# EAGLE design AD8232_Heart_Rate_Monitor_v10 (EAGLE 9.6.2)
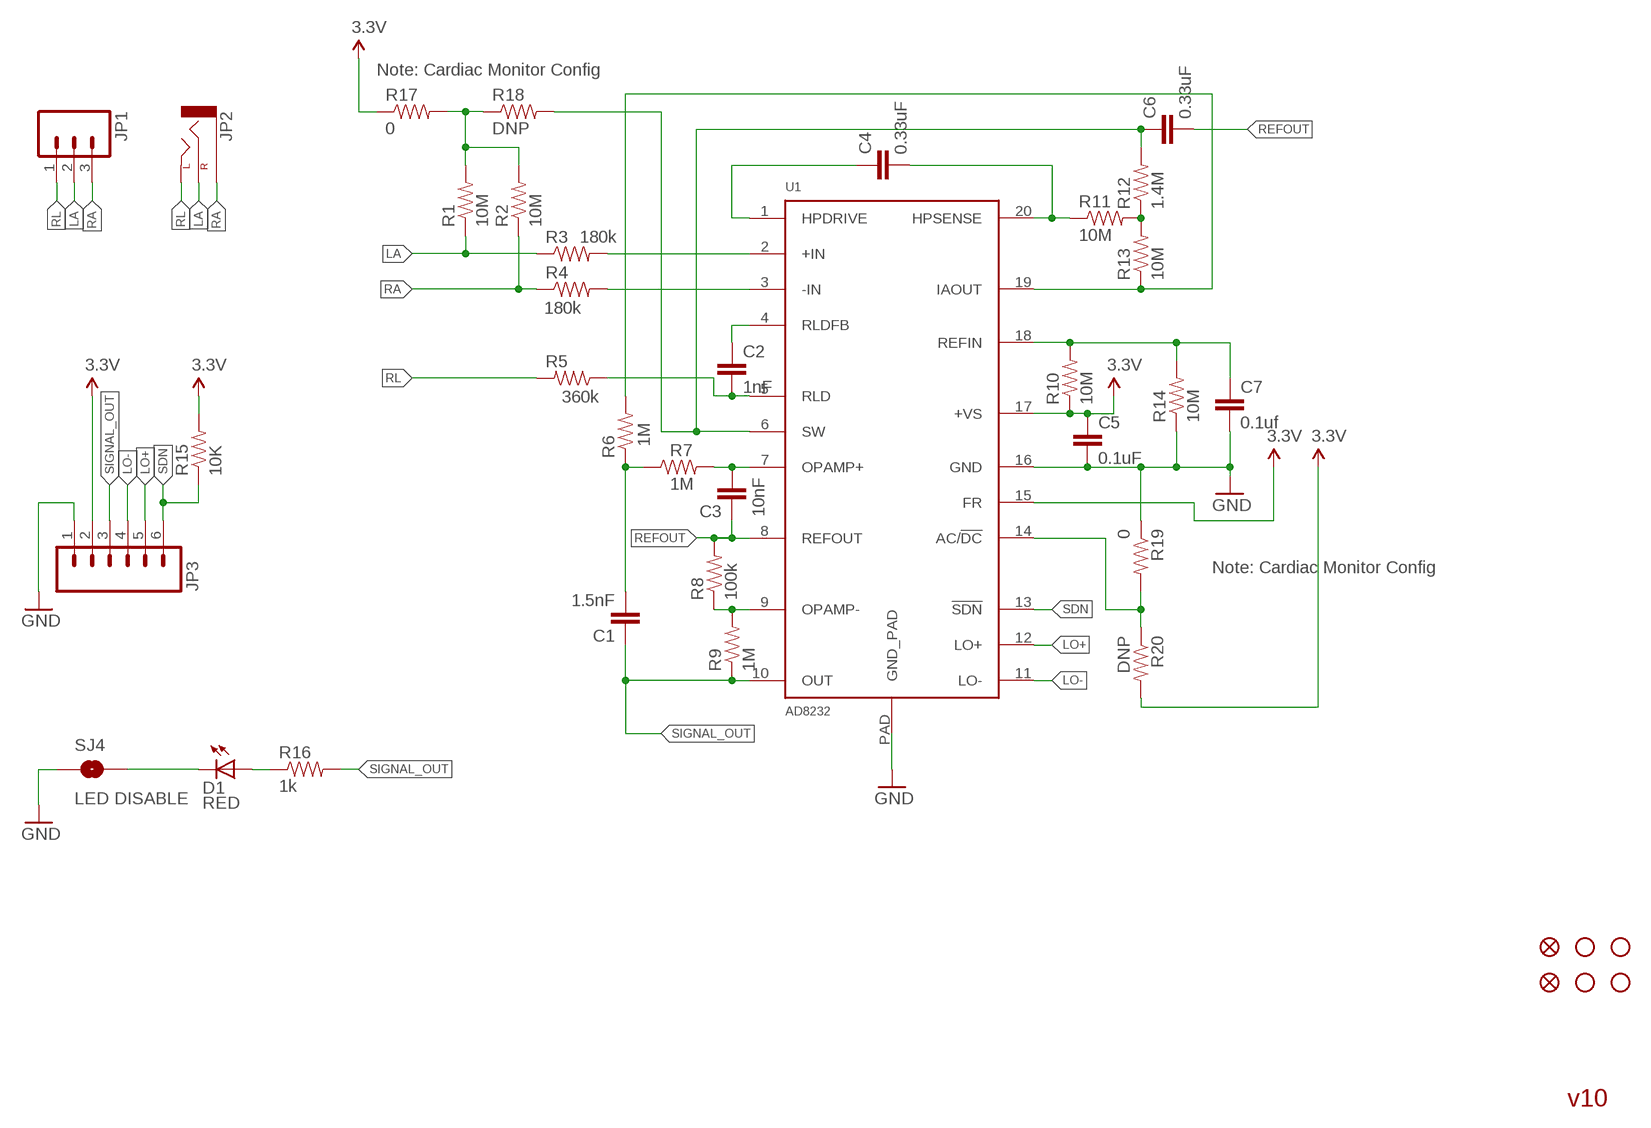
[diagram p0: schematic, sheet 1]

## Parts
C1  1.5nF  CAP0603-CAP  [0603-CAP]
C2  1nF  CAP0603-CAP  [0603-CAP]
C3  10nF  CAP0603-CAP  [0603-CAP]
C4  0.33uF  CAP0805  [0805]
C5  0.1uF  CAP0603-CAP  [0603-CAP]
C6  0.33uF  CAP0805  [0805]
C7  0.1uf  CAP0603-CAP  [0603-CAP]
D1  RED  LED-RED0603  [LED-0603]
FID1  FIDUCIAL1X2  [FIDUCIAL-1X2]
FID2  FIDUCIAL1X2  [FIDUCIAL-1X2]
JP1  M03PTH  [1X03]
JP2  AUDIO-JACKSMD2  [AUDIO-JACK-3.5MM-SMD]
JP3  M06SIP  [1X06]
R1  10M  RESISTOR0603-RES  [0603-RES]
R2  10M  RESISTOR0603-RES  [0603-RES]
R3  180k  RESISTOR0603-RES  [0603-RES]
R4  180k  RESISTOR0603-RES  [0603-RES]
R5  360k  RESISTOR0603-RES  [0603-RES]
R6  1M  RESISTOR0603-RES  [0603-RES]
R7  1M  RESISTOR0603-RES  [0603-RES]
R8  100k  RESISTOR0603-RES  [0603-RES]
R9  1M  RESISTOR0603-RES  [0603-RES]
R10  10M  RESISTOR0603-RES  [0603-RES]
R11  10M  RESISTOR0603-RES  [0603-RES]
R12  1.4M  RESISTOR0603-RES  [0603-RES]
R13  10M  RESISTOR0603-RES  [0603-RES]
R14  10M  RESISTOR0603-RES  [0603-RES]
R15  10K  10KOHM1/10W1%(0603)0603  [0603-RES]
R16  1k  1K-1%  [0603-RES]
R17  0  0OHM1/10W5%(0603)  [0603]
R18  DNP  0OHM1/10W5%(0603)  [0603]
R19  0  0OHM1/10W5%(0603)  [0603]
R20  DNP  0OHM1/10W5%(0603)  [0603]
SJ4  LED DISABLE  SOLDERJUMPERTRACE  [SJ_2S-TRACE]
STANDOFF1  STAND-OFF  [STAND-OFF]
STANDOFF2  STAND-OFF  [STAND-OFF]
STANDOFF3  STAND-OFF  [STAND-OFF]
STANDOFF4  STAND-OFF  [STAND-OFF]
U1  AD8232  [LFCSP_20]

## Nets
3.3V: C5.1 JP3.2 R10.1 R15.2 R17.1 R20.2 U1.15(FR) U1.17(+VS)
GND: C5.2 C7.2 JP3.1 R14.1 R19.1 SJ4.1 U1.16(GND) U1.PAD(GND_PAD)
LA: JP1.2 JP2.RING(RIGHT) R1.1 R3.1
LO+: JP3.5 U1.12(LO+)
LO-: JP3.4 U1.11(LO-)
N$1: R3.2 U1.2(+IN)
N$2: R4.2 U1.3(-IN)
N$3: C3.2 R7.2 U1.7(OPAMP+)
N$4: C4.2 R11.1 U1.20(HPSENSE)
N$5: C7.1 R10.2 R14.2 U1.18(REFIN)
N$6: D1.A R16.1
N$7: R8.1 R9.2 U1.9(OPAMP-)
N$8: R6.2 R13.1 U1.19(IAOUT)
N$9: C1.2 R6.1 R7.1
N$10: D1.C SJ4.2
N$11: R19.2 R20.1 U1.14(AC/!DC)
N$13: C4.1 U1.1(HPDRIVE)
N$14: R11.2 R12.1 R13.2
N$16: C6.1 R12.2 R18.2 U1.6(SW)
N$17: C2.1 U1.4(RLDFB)
N$18: C2.2 R5.1 U1.5(RLD)
N$20: R1.2 R2.2 R17.2 R18.1
RA: JP1.3 JP2.SLEEVE R2.1 R4.1
REFOUT: C3.1 C6.2 R8.2 U1.8(REFOUT)
RL: JP1.1 JP2.TIP(LEFT) R5.2
SDN: JP3.6 R15.1 U1.13(!SDN)
SIGNAL_OUT: C1.1 JP3.3 R9.1 R16.2 U1.10(OUT)

## Notes on the sheet
- Note: Cardiac Monitor Config
- Note: Cardiac Monitor Config
- v10

## Library data of the parts
C1-C7 = SparkFun-Passives:CAP: Capacitor Standard 0603 ceramic capacitor, and 0.1" leaded capacitor.
D1 = SparkFun-LED:LED-RED: Assorted Red LEDs LilyPad 1206- DIO-09912 1206- DIO-00809 0603- DIO-00819; PROD_ID: DIO-00819
FID1 FID2 = SparkFun-Aesthetics:FIDUCIAL: Fiducial Alignment Points Various fiducial points for machine vision alignment.
JP1 = SparkFun-Connectors:M03: Header 3 Standard 3-pin 0.1" header. Use with straight break away headers (SKU : PRT-00116), right angle break away headers (PRT-00553), swiss pins (PRT-00743), machine pins (PRT-00117), and female headers (PRT-00115). Molex polarized connector foot print use with SKU : PRT-08232 with associated crimp pins and housings.
JP2 = SparkFun-Connectors:AUDIO-JACK: 3.5mm Audio Jack Simple 3.5mm common PCB mount audio jack. SKU: PRT-08032; PROD_ID: CONN-10353
JP3 = SparkFun-Connectors:M06: Header 6 Standard 6-pin 0.1" header. Use with straight break away headers (SKU : PRT-00116), right angle break away headers (PRT-00553), swiss pins (PRT-00743), machine pins (PRT-00117), and female headers (PRT-00115). Molex polarized connector foot print use with SKU : PRT-08094 with associated crimp pins and housings. NOTES ON THE VARIANTS LOCK and LOCK_LONGPADS... This footprint was designed to help hold the alignment of a through-hole component (i.e. 6-pin header) while soldering it into place. You may notice that each hole has been shifted either up or down by 0.005 of an inch from it's more standard position (which is a perfectly straight line). This slight alteration caused the pins (the squares in the middle) to touch the edges of the holes. Because they are alternating, it causes a "brace" to hold the component in place. 0.005 has proven to be the perfect amount of "off-center" position when using our standard breakaway headers. Although looks a little odd when you look at the bare footprint, once you have a header in there, the alteration is very hard to notice. Also,if you push a header all the way into place, it is covered up entirely on the bottom side. This idea of altering the position of holes to aid alignment will be further integrated into the Sparkfun Library for other footprints. It can help hold any component with 3 or more connection pins.
R1-R14 = SparkFun-Passives:RESISTOR: Resistor Basic schematic elements and footprints for 0603, 1206, and PTH resistors.
R15 = SparkFun-Resistors:10KOHM1/10W1%(0603): RES-00824; PROD_ID: RES-00824
R16 = SparkFun-Resistors:1K-1%: 1k-ohm SMT 1/10W - 1% (0603) RES-07856; PROD_ID: RES-07856
R17 R19 = SparkFun-Resistors:0OHM1/10W5%(0603): RES-08609; PROD_ID: RES-08609
R18 R20 = SparkFun-Resistors:0OHM1/10W5%(0603): RES-08609; PROD_ID: RES-08609; VALUE: 0
SJ4 = SparkFun-Passives:SOLDERJUMPER: Solder Jumper Standard SMD solder jumper. Used to automate production. Two varients : Normally Open and Normally Closed are the same, but have different paste layers. NC will have a large amount of paste and should jumper during reflow.
STANDOFF1-STANDOFF4 = SparkFun-Electromechanical:STAND-OFF: #4 Stand Off This is the mechanical footprint for a #4 phillips button head screw. Use the keepout ring to avoid running the screw head into surrounding components. SKU : PRT-00447
U1 = AD8232:AD8232

## Board
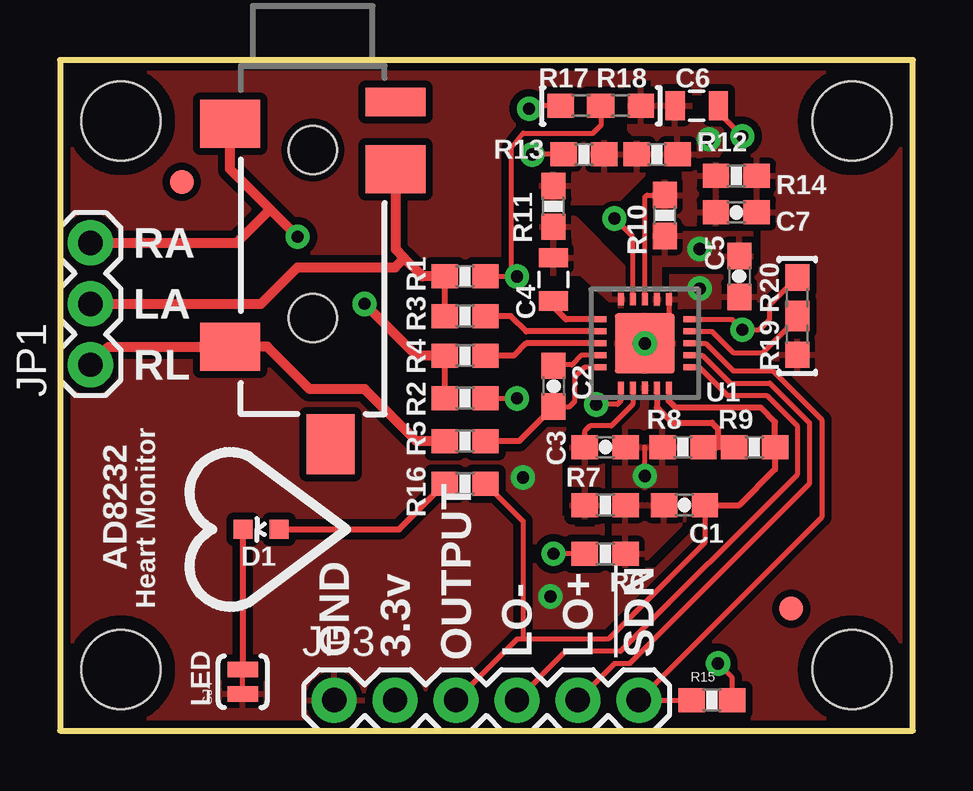
[diagram p1: board, top side]
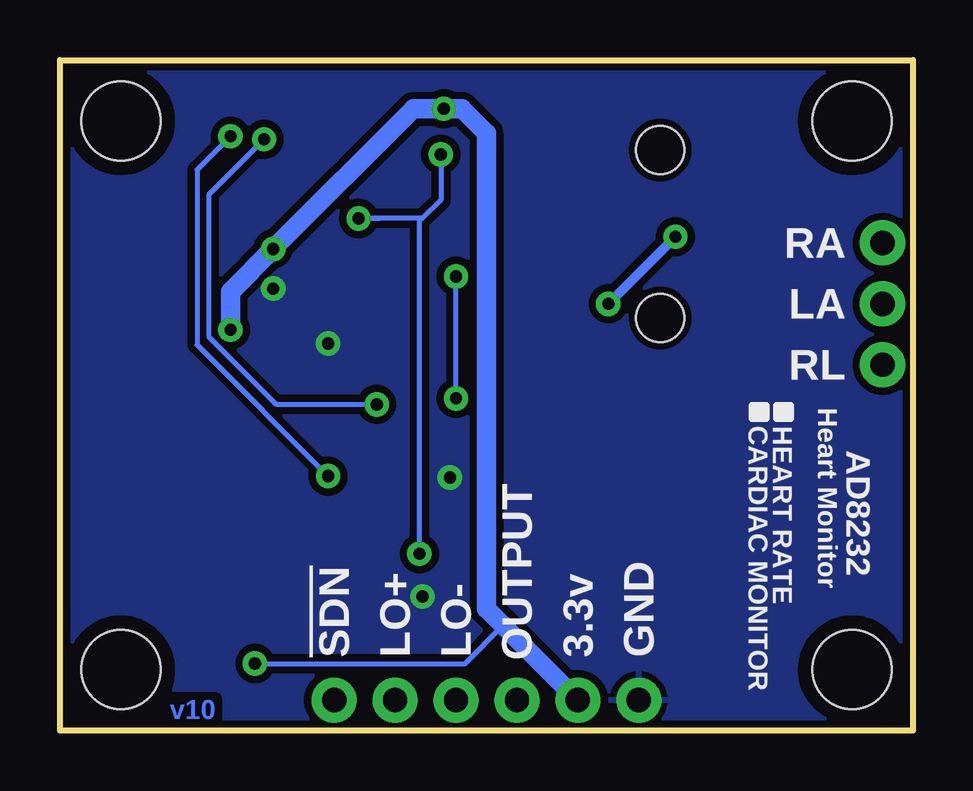
[diagram p2: board, bottom side, seen from below]

Size 35.56 x 27.94 mm. Coordinates in mm from the lower left corner, seen from the top.
Outline: 35.56,0 35.56,27.94 0,27.94 0,0 35.56,0
Copper layers (1*16): Top 0.035mm / dielectric 1.5mm / Bottom 0.035mm
Design rules "default": minimum track width 7mil, minimum drill 15mil, track to track 6mil, track to pad 8mil, pad to pad 8mil, via to via 8mil, smd to smd 8mil, copper to edge 8mil, drill to drill 8mil, minimum pad ring 12mil, minimum via ring 10mil, stop-mask expansion 4mil, vias tented up to drill 20mil, thermal gap 10mil

### Footprints (pad centres in the part's own frame; a part is rotated, then mirrored left to right if it is on the bottom)
0603-CAP = smd 1.1 x 1: 1 -0.85,0; 2 0.85,0
0805 = smd 0.8 x 1.2: 1 -0.9,0; 2 0.9,0
LED-0603 = smd 0.8 x 0.8: A 0,-0.75; C 0,0.75
FIDUCIAL-1X2 = smd 1 x 1: 1 0,0
1X03 = drill 1.016 pad 1.88: 1 0,0; 2 2.54,0; 3 5.08,0
AUDIO-JACK-3.5MM-SMD = smd 2 x 2.5: RING 4.3,3.45; SLEEVE 2.4,-3.45; TIP 11.7,-3.45 | smd 1.2 x 2.5: RSH 1.5,3.45 | smd 2.5 x 2: TSH 15.75,0.75 | hole 2: 3.5,0; 10.5,0
1X06 = drill 1.016 pad 1.88: 1 0,0; 2 2.54,0; 3 5.08,0; 4 7.62,0; 5 10.16,0; 6 12.7,0
0603-RES = smd 1.1 x 1: 1 -0.85,0; 2 0.85,0
0603 = smd 1.1 x 1: 1 -0.85,0; 2 0.85,0
SJ_2S-TRACE = smd 0.635 x 1.27: 1 -0.508,0; 2 0.508,0
STAND-OFF = hole 3.302: 0,0
LFCSP_20 = smd 0.5 x 0.25: 1 -1.85,1; 2 -1.85,0.5; 3 -1.85,0; 4 -1.85,-0.5; 5 -1.85,-1; 11 1.85,-1; 12 1.85,-0.5; 13 1.85,0; 14 1.85,0.5; 15 1.85,1 | smd 0.25 x 0.5: 6 -1,-1.85; 7 -0.5,-1.85; 8 0,-1.85; 9 0.5,-1.85; 10 1,-1.85; 16 1,1.85; 17 0.5,1.85; 18 0,1.85; 19 -0.5,1.85; 20 -1,1.85 | smd 2.5 x 2.5: PAD 0,0

### Placement (x,y rotation side)
C1  26.04,9.4 180 top
C2  20.57,14.35 270 top
C3  22.73,11.81 180 top
C4  20.57,18.8 90 top
C5  28.32,18.92 270 top
C6  26.54,26.04 0 top
C7  28.19,21.59 0 top
D1  8.38,8.38 90 top
FID1  5.08,22.86 0 top
FID2  30.48,5.08 0 top
JP1  1.27,15.24 90 top
JP2  10.54,27.69 270 top
JP3  11.43,1.27 0 top
R1  16.89,18.92 0 top
R2  16.89,13.84 0 top
R3  16.89,17.27 0 top
R4  16.89,15.62 0 top
R5  16.89,12.06 180 top
R6  22.73,7.37 180 top
R7  22.73,9.4 180 top
R8  25.97,11.81 180 top
R9  28.96,11.81 180 top
R10  25.21,21.46 90 top
R11  20.57,21.84 90 top
R12  24.89,24 0 top
R13  21.84,24 0 top
R14  28.19,23.11 180 top
R15  27.18,1.27 0 top
R16  16.89,10.29 0 top
R17  21.72,26.04 0 top
R18  23.37,26.04 0 top
R19  30.73,16.51 90 top
R20  30.73,18.03 90 top
SJ4  7.62,2.03 90 top
STANDOFF1  2.54,25.4 0 top
STANDOFF2  33.02,25.4 0 top
STANDOFF3  33.02,2.54 0 top
STANDOFF4  2.54,2.54 0 top
U1  24.38,16.13 0 top

### Tracks (layer width: path | path; a pad name or v marks a point on that pad's centre or on a via)
3.3V  (via drill 0.51, 0.51 pad 0.3)
  Top 0.203: R15.2 28.03,2.2 v27.43,2.79 | U1.15 28.02,17.13 v28.45,16.7 29.15,16.7 29.59,17.14 29.59,17.74 R20.2 | R17.1 19.68,26.04 v19.56,25.91
  Bottom 0.203: v27.43,2.79 18.67,2.79 17.08,4.38
  Bottom 0.813: v28.45,16.7 28.45,18.29 v26.67,20.07 20.83,25.91 v19.56,25.91 18.8,25.91 17.78,24.89 17.78,5.08 17.08,4.38 JP3.2
  pour Top (isolate 0.203): 24.77,17.78 25.02,17.78 25.02,19.43 28.83,19.43 28.83,20.7 24.77,20.7
GND  (via drill 0.51)
  Top 0.203: 24.88,16.63 U1.PAD 25.38,17.13 U1.16
  other vias: 26.67,18.41 24.38,16.13 20.45,5.59 19.3,10.54
  pour Top (isolate 0.305, rank 6): 0,27.94 35.56,27.94 35.56,0 0,0
  pour Bottom (isolate 0.305, rank 6): 0,27.94 35.56,27.94 35.56,0 0,0
LA
  Top 0.254: R1.1 R3.1
  Top 0.406: R1.1 15.11,18.92 14.35,19.68 | 14.35,19.68 13.99,20.05 JP2.RING | JP1.2 8.38,17.78 9.91,19.3 13.97,19.3 14.35,19.68
LO+
  Top 0.203: U1.12 26.79,15.63 27.94,14.48 29.59,14.48 31.24,12.83 31.24,10.29 23.75,2.79 23.11,2.79 JP3.5
LO-
  Top 0.203: U1.11 26.65,15.13 27.81,13.97 29.46,13.97 30.73,12.7 30.73,10.67 23.37,3.3 21.08,3.3 JP3.4
N$1
  Top 0.254: U1.2 19.44,16.63 18.8,17.27 R3.2
N$2
  Top 0.254: U1.3 19.43,16.13 18.92,15.62 R4.2
N$3
  Top 0.203: U1.7 23.88,13.6 22.99,12.7 22.1,12.7 21.88,12.48 C3.2
  pour Top (isolate 0.203): 21.34,12.32 22.61,12.32 22.61,8.89 21.34,8.89
N$4
  pour Top (isolate 0.203): 23.5,17.65 23.5,19.3 21.46,21.34 20.07,21.34 20.07,19.05 21.72,19.05 23.24,17.65
N$5
  Top 0.203: U1.18 24.38,22.23 24.47,22.31 R10.2
  pour Top (isolate 0.203, rank 2): 26.04,23.62 27.81,23.62 27.81,21.08 26.16,21.08 25.78,21.46 24.77,21.46 24.77,22.86 26.04,22.86
N$6
  Top 0.254: D1.A 14.14,8.38 R16.1
N$7
  Top 0.254: U1.9 24.88,13.47 25.53,12.83 27.18,12.83 27.43,12.57 27.43,11.81 | R8.1 27.43,11.81 | R9.2 27.43,11.81
N$8  (via drill 0.51)
  Top 0.203: U1.19 23.88,20.57 v23.11,21.34 | R13.1 v19.68,24 | R6.2 v20.57,7.37
  Bottom 0.203: 22.23,21.34 v23.11,21.34 20.57,21.34 | 20.57,21.34 20.45,21.34 19.68,22.1 v19.68,24 | v20.57,7.37 20.57,21.34
N$9
  pour Top (isolate 0.203): 23.11,9.78 26.04,9.78 26.04,8.76 24.13,6.86 23.11,6.86
N$10
  Top 0.254: D1.C SJ4.2
N$11
  Top 0.203: U1.14 27.19,16.63 28.07,15.75 29.3,15.75 R20.1 R19.2
N$13
  Top 0.254: U1.1 21.1,17.13 20.57,17.65 C4.1
N$14
  pour Top (isolate 0.203, rank 2): 21.84,24.51 24.64,24.51 24.64,23.5 23.11,21.97 20.07,21.97 20.07,23.37 21.84,23.37
N$16  (via drill 0.51)
  Top 0.203: 25.78,24 R12.2 | U1.6 23.38,13.73 23.24,13.59 v22.35,13.59
  Bottom 0.203: v27.05,24.64 29.34,22.35 29.34,16.38 26.54,13.59 v22.35,13.59
  pour Top (isolate 0.254): 25.27,23.75 27.3,23.75 27.69,24.38 27.69,24.89 27.3,25.27 26.42,25.27 26.29,25.4 26.29,26.42 24.64,26.42 24.38,26.67 23.75,26.67 23.75,25.02
N$17
  Top 0.203: U1.4 21.73,15.63 21.34,15.24 20.57,15.24 C2.1
N$18
  Top 0.203: C2.2 21.25,13.5 21.46,13.72 21.46,14.73 21.86,15.13 U1.5 | R5.1 17.78,12.06
  Top 0.254: C2.2 19.14,12.06 17.78,12.06
N$20  (via drill 0.51)
  Top 0.203: R2.2 v19.05,13.84 | R1.2 v19.05,18.92 18.8,19.18 18.8,24.26 19.3,24.89 22.23,24.89 22.57,25.23 R17.2 R18.1
  Bottom 0.203: v19.05,13.84 v19.05,18.92
RA  (via drill 0.51)
  Top 0.254: R4.1 R2.1
  Top 0.406: R4.1 14.86,15.62 v12.7,17.78 | v9.91,20.57 8.76,21.72 | 8.76,21.72 7.09,23.39 JP2.SLEEVE | JP1.3 7.37,20.32 8.76,21.72
  Bottom 0.406: v12.7,17.78 v9.91,20.57
REFOUT  (via drill 0.51)
  Top 0.203: C6.2 27.43,25.78 v28.45,24.77 | v24.38,10.6 24.38,11.81
  Top 0.254: R8.2 25.15,11.94
  Bottom 0.203: v28.45,24.77 29.84,23.37 29.84,16.07 v24.38,10.6
  pour Top (isolate 0.203, rank 2): 24.13,14.48 24.64,14.48 24.64,13.08 25.15,12.57 25.65,12.57 25.65,10.03 23.11,10.03 23.11,12.45 24.13,13.46
RL
  Top 0.406: R5.2 14.86,12.06 12.7,14.22 10.41,14.22 8.64,16 7.11,16 JP2.TIP 2.02,15.99 JP1.1
SDN
  Top 0.203: U1.13 26.92,16.13 28.07,14.99 29.72,14.99 31.75,12.95 31.75,8.89 JP3.6 R15.1
SIGNAL_OUT
  Top 0.203: C1.1 26.89,7.83 22.86,3.81 19.3,3.81 | 19.3,3.81 19.05,3.81 JP3.3 | R16.2 19.3,8.72 19.3,3.81
  Top 0.254: U1.10 25.38,13.73 25.65,13.46 29.21,13.46 29.81,12.87 R9.1 29.81,10.88 28.32,9.4 C1.1

### Text on the board
Bottom: v10
tPlace: RA | LA | RL | AD8232 | Heart Monitor | GND | 3.3v | OUTPUT | LO- | LO+ | !SDN | LED
bPlace: RA | LA | RL | Heart Monitor | HEART RATE | CARDIAC MONITOR | AD8232 | GND | 3.3v | OUTPUT | LO- | LO+ | !SDN